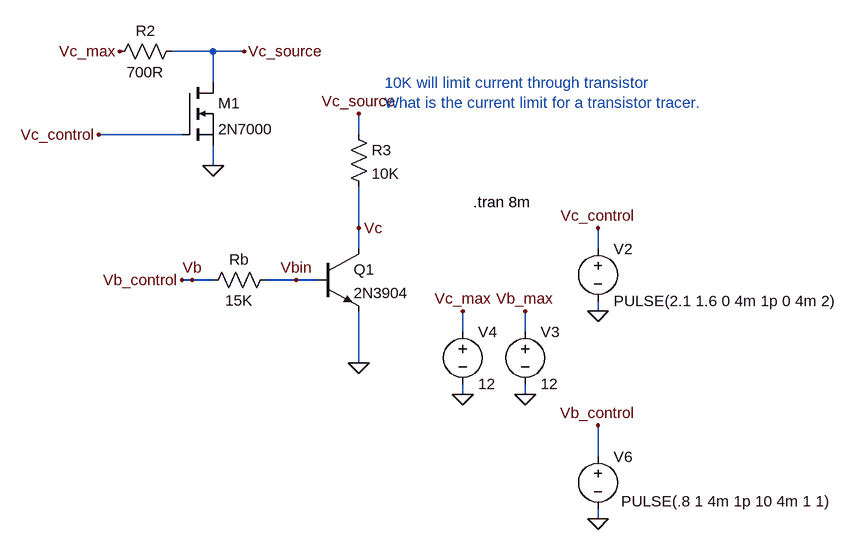
[diagram p0: schematic NPN FET Configuration.asc]
NPN FET Configuration.asc, the LTspice schematic file:
Version 4
SHEET 1 2524 804
WIRE 400 -400 336 -400
WIRE 448 -400 400 -400
WIRE 400 -352 400 -400
WIRE 352 -272 224 -272
WIRE 624 -272 624 -304
WIRE 400 -224 400 -256
WIRE 624 -128 624 -192
WIRE 624 -96 624 -128
WIRE 992 -96 992 -128
WIRE 368 -48 352 -48
WIRE 400 -48 368 -48
WIRE 528 -48 480 -48
WIRE 560 -48 528 -48
WIRE 992 0 992 -16
WIRE 784 32 784 0
WIRE 880 32 880 0
WIRE 624 80 624 0
WIRE 784 128 784 112
WIRE 880 128 880 112
WIRE 992 224 992 176
WIRE 992 320 992 304
FLAG 400 -224 0
FLAG 784 128 0
FLAG 624 -128 Vc
FLAG 368 -48 Vb
FLAG 784 0 Vc_max
FLAG 992 -128 Vc_control
FLAG 992 0 0
FLAG 992 176 Vb_control
FLAG 528 -48 Vbin
FLAG 352 -48 Vb_control
FLAG 880 128 0
FLAG 880 0 Vb_max
FLAG 992 320 0
FLAG 256 -400 Vc_max
FLAG 224 -272 Vc_control
FLAG 448 -400 Vc_source
FLAG 624 80 0
FLAG 624 -304 Vc_source
SYMBOL npn 560 -96 R0
SYMATTR InstName Q1
SYMATTR Value 2N3904
SYMBOL voltage 784 16 R0
WINDOW 123 0 0 Left 2
WINDOW 39 0 0 Left 2
SYMATTR InstName V4
SYMATTR Value 12
SYMBOL res 496 -64 R90
WINDOW 0 0 56 VBottom 2
WINDOW 3 32 56 VTop 2
SYMATTR InstName Rb
SYMATTR Value 15K
SYMBOL voltage 992 -112 R0
WINDOW 123 0 0 Left 2
WINDOW 39 0 0 Left 2
SYMATTR InstName V2
SYMATTR Value PULSE(2.1 1.6 0 4m 1p 0 4m 2)
SYMBOL voltage 880 16 R0
WINDOW 123 0 0 Left 2
WINDOW 39 0 0 Left 2
SYMATTR InstName V3
SYMATTR Value 12
SYMBOL voltage 992 208 R0
WINDOW 123 0 0 Left 2
WINDOW 39 0 0 Left 2
WINDOW 3 36 85 Left 2
SYMATTR Value PULSE(.8 1 4m 1p 10 4m 1 1)
SYMATTR InstName V6
SYMBOL nmos 352 -352 R0
SYMATTR InstName M1
SYMATTR Value 2N7000
SYMBOL res 608 -288 R0
SYMATTR InstName R3
SYMATTR Value 10K
SYMBOL res 352 -416 R90
WINDOW 0 0 56 VBottom 2
WINDOW 3 32 56 VTop 2
SYMATTR InstName R2
SYMATTR Value 700R
TEXT 800 -168 Left 2 !.tran 8m
TEXT 664 -352 Left 2 ;10K will limit current through transistor\nWhat is the current limit for a transistor tracer.

The netlist it stands for:
* NPN FET Configuration.asc
Q1 Vc Vbin 0 0 2N3904
V4 Vc_max 0 12
Rb Vbin Vb_control 15K
V2 Vc_control 0 PULSE(2.1 1.6 0 4m 1p 0 4m 2)
V3 Vb_max 0 12
V6 Vb_control 0 PULSE(.8 1 4m 1p 10 4m 1 1)
M1 Vc_source Vc_control 0 0 2N7000
R3 Vc_source Vc 10K
R2 Vc_source Vc_max 700R
.model NPN NPN
.model PNP PNP
.lib standard.bjt
.model NMOS NMOS
.model PMOS PMOS
.lib standard.mos
.tran 8m
* 10K will limit current through transistor
* What is the current limit for a transistor tracer.
.backanno
.end